# EAGLE design Dachmodul-KS (EAGLE 8.2.0)
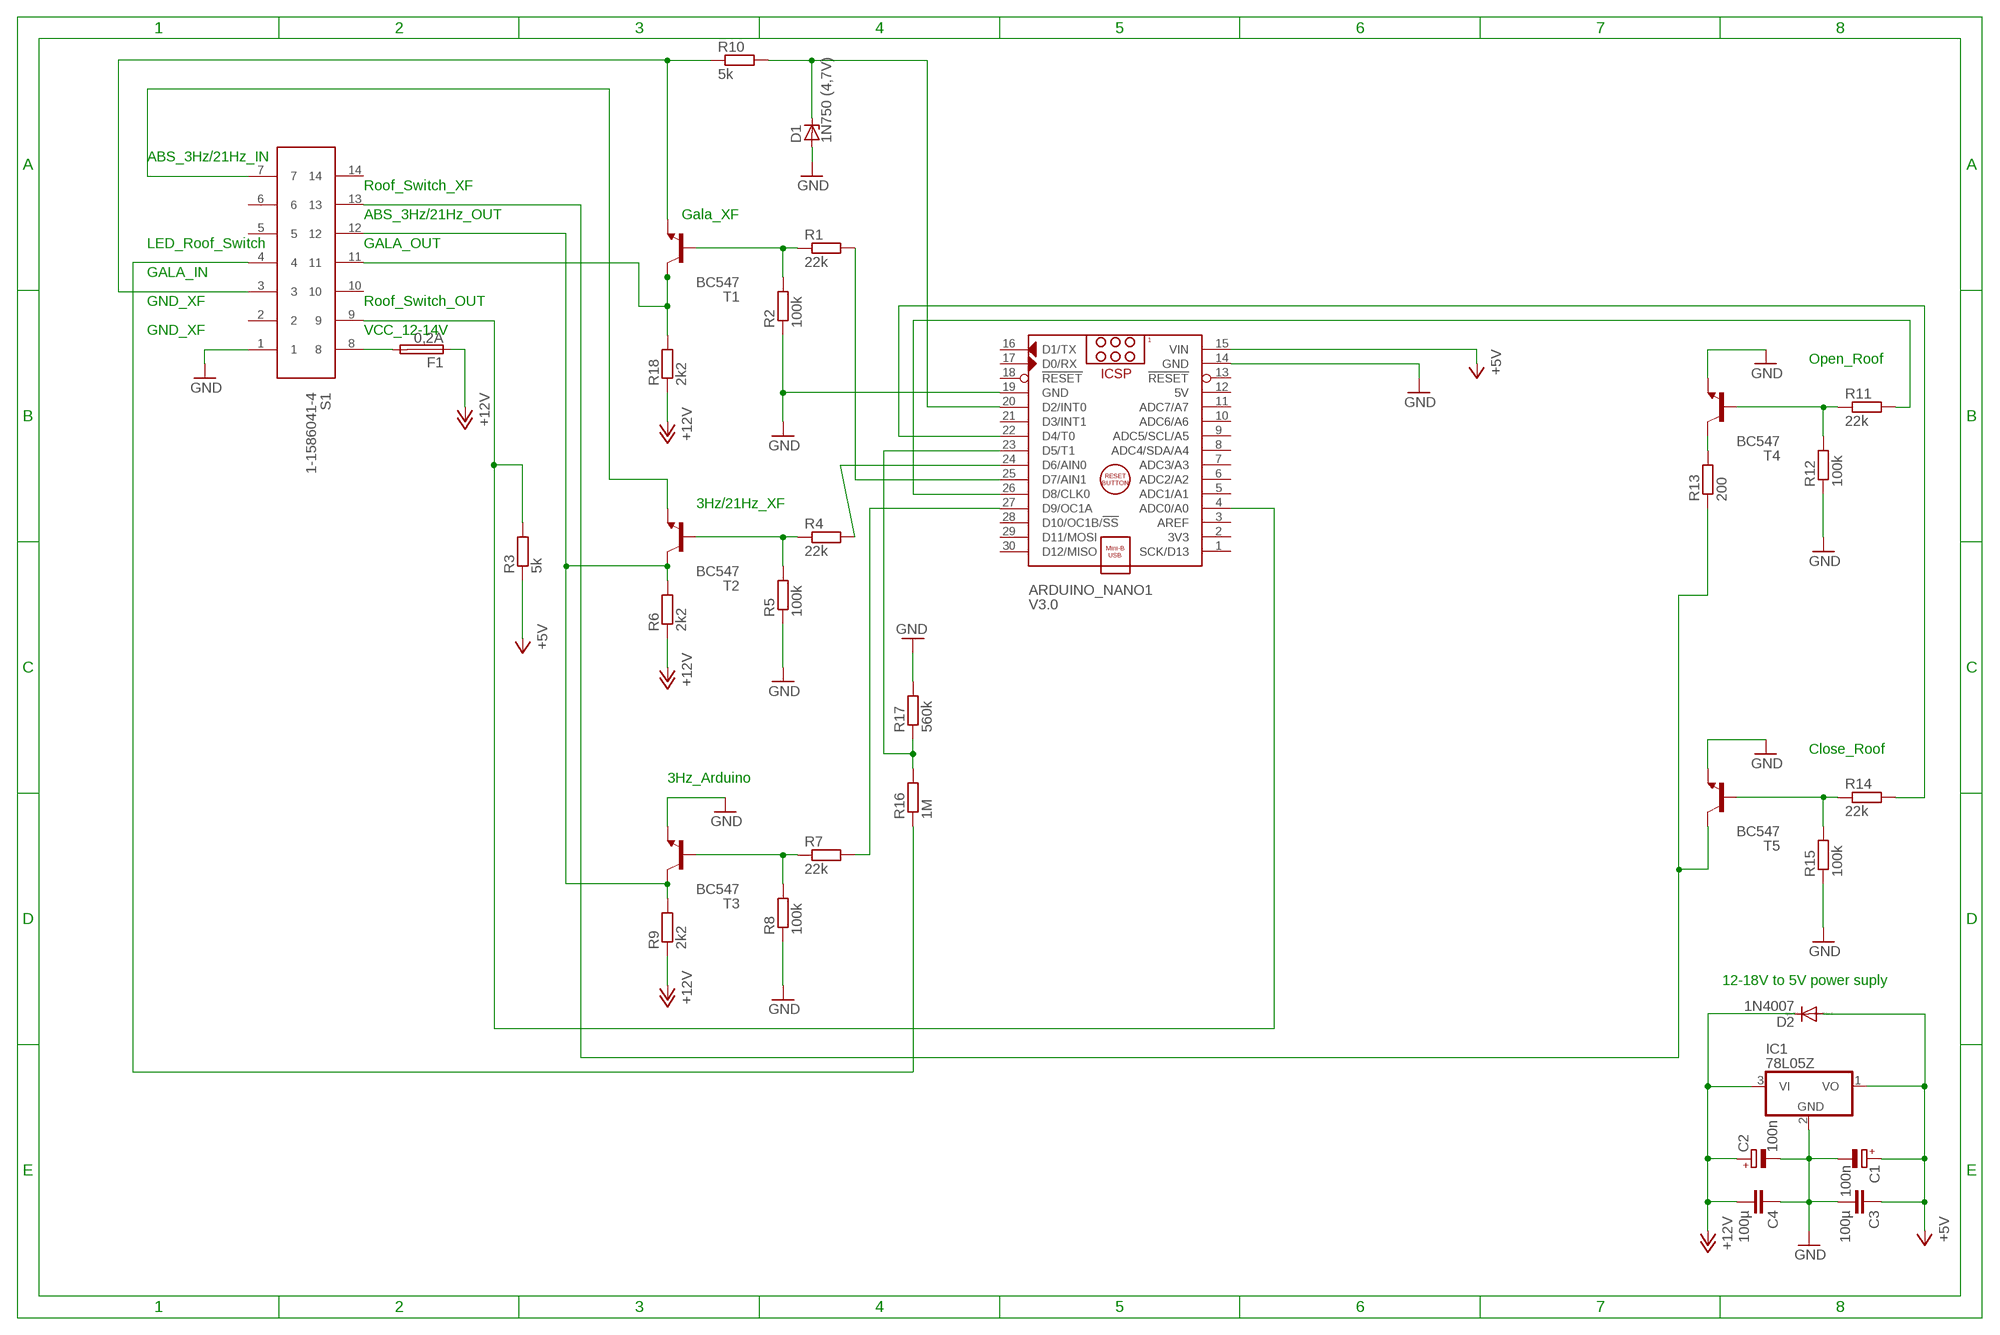
[diagram p0: schematic, sheet 1]

## Parts
ARDUINO_NANO1  V3.0  ARDUINO_NANO  [ARDUINO_NANO]
C1  100n  CPOL-EUE3.5-8  [E3,5-8]
C2  100n  CPOL-EUE3.5-8  [E3,5-8]
C3  100µ  C-EU025-025X050  [C025-025X050]
C4  100µ  C-EU025-025X050  [C025-025X050]
D1  1N750 (4,7V)  ZENER-DIODEZD-2.5  [ZDIO-2.5]
D2  1N4007  1N4004  [DO41-10]
F1  0,2A  SH22,5A  [SH22,5A]
IC1  78L05Z  [TO92]
R1  22k  R-EU_0207/10  [0207/10]
R2  100k  R-EU_0207/10  [0207/10]
R3  5k  R-EU_0207/10  [0207/10]
R4  22k  R-EU_0207/10  [0207/10]
R5  100k  R-EU_0207/10  [0207/10]
R6  2k2  R-EU_0207/10  [0207/10]
R7  22k  R-EU_0207/10  [0207/10]
R8  100k  R-EU_0207/10  [0207/10]
R9  2k2  R-EU_0207/10  [0207/10]
R10  5k  R-EU_0207/10  [0207/10]
R11  22k  R-EU_0207/10  [0207/10]
R12  100k  R-EU_0207/10  [0207/10]
R13  200  R-EU_0207/10  [0207/10]
R14  22k  R-EU_0207/10  [0207/10]
R15  100k  R-EU_0207/10  [0207/10]
R16  1M  R-EU_0207/10  [0207/10]
R17  560k  R-EU_0207/10  [0207/10]
R18  2k2  R-EU_0207/10  [0207/10]
S1  1-1586041-4  64901421022  [64901421022]
T1  BC547  [TO92]
T2  BC547  [TO92]
T3  BC547  [TO92]
T4  BC547  [TO92]
T5  BC547  [TO92]

## Nets
+5V: ARDUINO_NANO1.15(VIN) C1.+ C3.1 D2.A IC1.1(VO) R3.1
+12V: C2.+ C4.2 D2.C F1.1 IC1.3(VI) R6.1 R9.1 R18.1
GND: ARDUINO_NANO1.14(GND) ARDUINO_NANO1.19(GND) C1.- C2.- C3.2 C4.1 D1.A IC1.2(GND) R2.1 R5.1 R8.1 R12.1 R15.1 R17.2 S1.1 T3.1(E) T4.1(E) T5.1(E)
N$1: R1.1 R2.2 T1.2(B)
N$2: R18.2 S1.11 T1.3(C)
N$3: R4.1 R5.2 T2.2(B)
N$4: R6.2 R9.2 S1.12 T2.3(C) T3.3(C)
N$5: R7.1 R8.2 T3.2(B)
N$6: ARDUINO_NANO1.27(D9/OC1A) R7.2
N$7: S1.7 T2.1(E)
N$8: ARDUINO_NANO1.24(D6/AIN0) R4.2
N$9: R10.1 S1.3 T1.1(E)
N$11: ARDUINO_NANO1.25(D7/AIN1) R1.2
N$12: F1.2 S1.8
N$13: R13.2 T4.3(C)
N$14: R11.1 R12.2 T4.2(B)
N$15: ARDUINO_NANO1.26(D8/CLK0) R11.2
N$16: R13.1 S1.13 T5.3(C)
N$17: R14.1 R15.2 T5.2(B)
N$18: ARDUINO_NANO1.22(D4/T0) R14.2
N$20: R16.1 S1.4
N$21: ARDUINO_NANO1.23(D5/T1) R16.2 R17.1
N$35: ARDUINO_NANO1.4(ADC0/A0) R3.2 S1.9
N$36: ARDUINO_NANO1.20(D2/INT0) D1.C R10.2
Unconnected: ARDUINO_NANO1.1(SCK/D13) ARDUINO_NANO1.2(3V3) ARDUINO_NANO1.3(AREF) ARDUINO_NANO1.5(ADC1/A1) ARDUINO_NANO1.6(ADC2/A2) ARDUINO_NANO1.7(ADC3/A3) ARDUINO_NANO1.8(ADC4/SDA/A4) ARDUINO_NANO1.9(ADC5/SCL/A5) ARDUINO_NANO1.10(ADC6/A6) ARDUINO_NANO1.11(ADC7/A7) ARDUINO_NANO1.13(!RESET) ARDUINO_NANO1.16(D1/TX) ARDUINO_NANO1.17(D0/RX) ARDUINO_NANO1.18(!RESET) ARDUINO_NANO1.21(D3/INT1) ARDUINO_NANO1.28(D10/OC1B/!SS) ARDUINO_NANO1.29(D11/MOSI) ARDUINO_NANO1.30(D12/MISO) S1.2 S1.5 S1.6 S1.10 S1.14

## Notes on the sheet
- ABS_3Hz/21Hz_IN
- Roof_Switch_XF
- ABS_3Hz/21Hz_OUT | Gala_XF
- LED_Roof_Switch | GALA_OUT
- GALA_IN
- GND_XF | Roof_Switch_OUT
- GND_XF | VCC_12-14V
- Open_Roof
- 3Hz/21Hz_XF
- Close_Roof
- 3Hz_Arduino
- 12-18V to 5V power suply

## Power pins joined to a net without a drawn wire
5V: ARDUINO_NANO1.12(5V)

## Library data of the parts
ARDUINO_NANO1 = ArduinoNanoV30:ARDUINO_NANO: Arduino Nano V3.0 Module Overview: The Arduino Nano is a small, complete, and breadboard-friendly board based on the ATmega328 (Arduino Nano 3.x) or ATmega168 (Arduino Nano 2.x). It has more or less the same functionality of the Arduino Duemilanove, but in a different package. It lacks only a DC power jack, and works with a Mini-B USB cable instead of a standard one. The Nano was designed and is being produced by Gravitech <http://www.gravitech.us/arna30wiatp.html>. General specifications: Item Value Microcontroller Atmel ATmega168 or ATmega328 Operating Voltage (logic level) 5 V Input Voltage (recommended) 7-12 V Input Voltage (limits) 6-20 V Digital I/O Pins 14 (of which 6 provide PWM output) Analog Input Pins 8 DC Current per I/O Pin 40 mA Flash Memory 16 KB (ATmega168) or 32 KB (ATmega328) of which 2 KB used by bootloader SRAM 1 KB (ATmega168) or 2 KB (ATmega328) EEPROM 512 bytes (ATmega168) or 1 KB (ATmega328) Clock Speed 16 MHz Dimensions (Inches) 0.73" x 1.70" Dimensions (mm) 18mm x 45mm Overall height About 9 mm (not including pins) Weigth 5 g Power: The Arduino Nano can be powered via the Mini-B USB connection, 6-20V unregulated external power supply (pin 30), or 5V regulated external power supply (pin 27). The power source is automatically selected to the highest voltage source. Memory: The ATmega168 has 16 KB of flash memory for storing code (of which 2 KB is used for the bootloader); the ATmega328 has 32 KB, (also with 2 KB used for the bootloader). The ATmega168 has 1 KB of SRAM and 512 bytes of EEPROM (which can be read and written with the EEPROM library); the ATmega328 has 2 KB of SRAM and 1 KB of EEPROM. Input and Output: Each of the 14 digital pins on the Nano can be used as an input or output, using pinMode(), digitalWrite(), and digitalRead() functions. They operate at 5 volts. Each pin can provide or receive a maximum of 40 mA and has an internal pull-up resistor (disconnected by default) of 20-50 kOhms. In addition, some pins have specialized functions. Visit Arduino - ArduinoBoardNano <https://www.arduino.cc/en/Main/ArduinoBoardNano>
C1 C2 = rcl:CPOL-EU: POLARIZED CAPACITOR, European symbol
C3 C4 = rcl:C-EU: CAPACITOR, European symbol
D1 = diode:ZENER-DIODE: Z-Diode
D2 = diode:1N4004: DIODE general purpose rectifier, 1 A
F1 = fuse:SH22,5A: FUSE HOLDER grid 22,5mm, isolated cap OGN0031 8201, Schurter (Buerklin); MPN: 0031.7701.11; OC_FARNELL: unknown; OC_NEWARK: 04F1224
IC1 = linear:78*: Positive VOLTAGE REGULATOR Source: http://cache.national.com/ds/LM/LM78L05.pdf http://www.fairchildsemi.com/ds/LM/LM7805.pdf
R1-R18 = resistor:R-EU_: RESISTOR, European symbol
S1 = Wuerth_Elektronik_eiCan_Mini_Power_Connectors:64901421022: WR-MPC4-4.20mm Male Dual Row Angled Header with Mounting Flanges for Screw-in Retention,14 pins
T1-T5 = transistor:BC547: NPN TRANSISTOR

## Net classes
0 default: clearance 0.205 mm

## Board
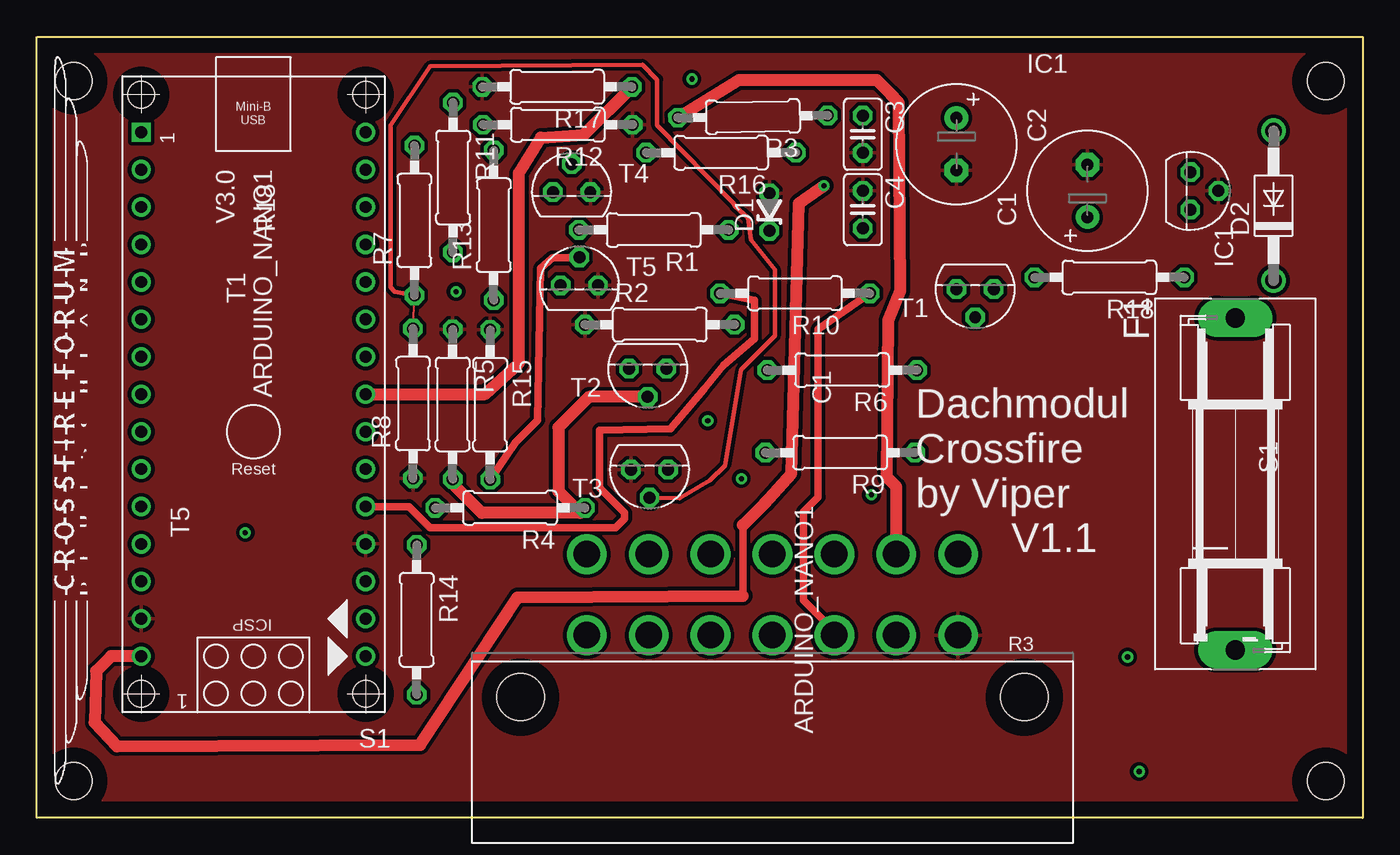
[diagram p1: board, top side]
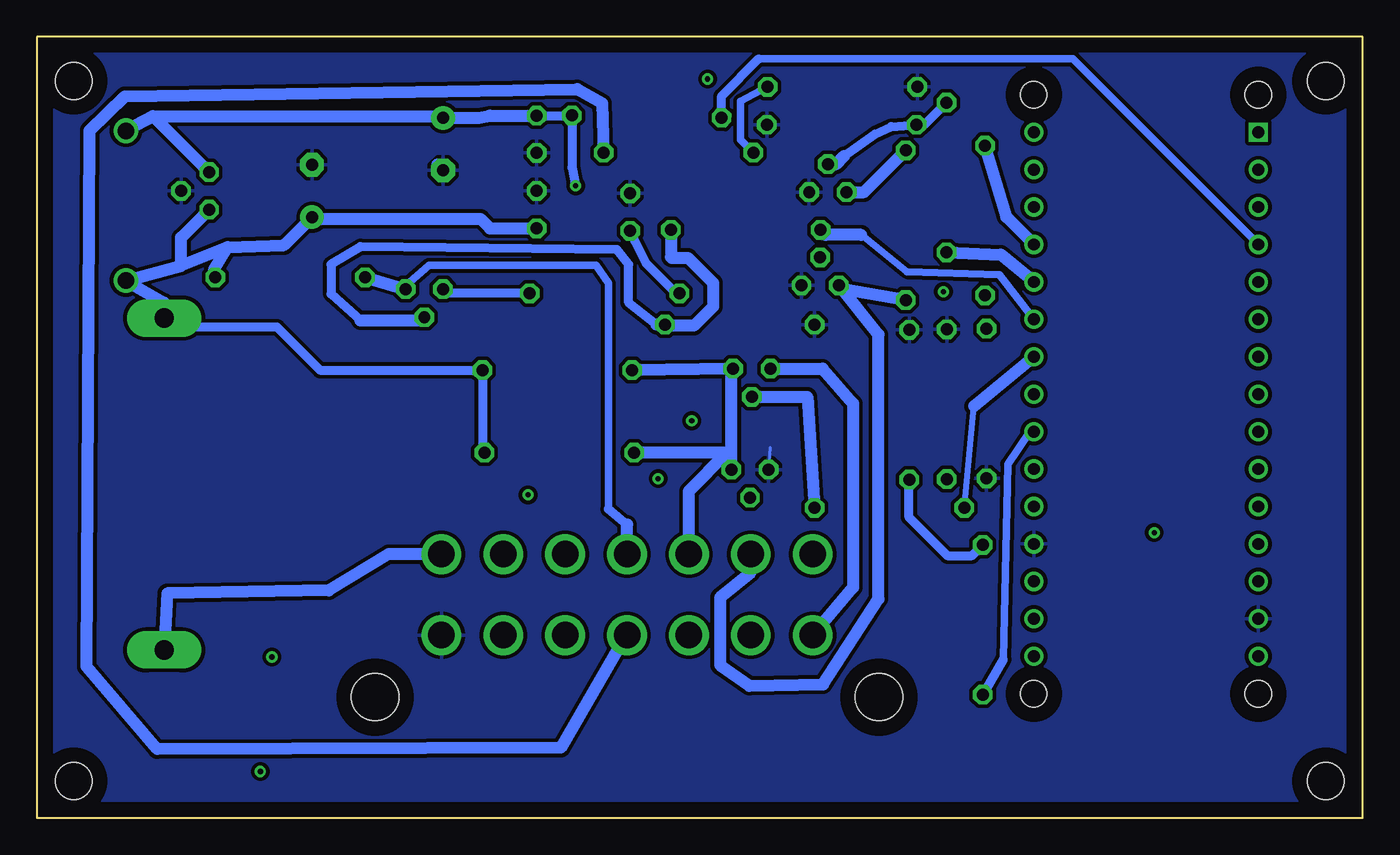
[diagram p2: board, bottom side, seen from below]

Size 90 x 53 mm. Coordinates in mm from the lower left corner, seen from the top.
Outline: 0,0 0,53 90,53 90,0 0,0
Copper layers (1*16): Top 0.035mm / dielectric 0.1mm / Bottom 0.035mm
Design rules "default *": minimum track width 6mil, minimum drill 0.35mm, track to track 6mil, track to pad 6mil, pad to pad 6mil, via to via 6mil, smd to smd 6mil, copper to edge 40mil, drill to drill 6mil, minimum pad ring 10mil, minimum via ring 8mil, stop-mask expansion 4mil, vias tented up to drill 0mil, thermal gap 10mil
Holes 2.5 mm at 2.5,2.5 87.5,2.5 87.5,50 2.5,50

### Footprints (pad centres in the part's own frame; a part is rotated, then mirrored left to right if it is on the bottom)
ARDUINO_NANO = drill 0.8 square: 1 -20.32,-7.62 | drill 0.8: 2 -17.78,-7.62; 3 -15.24,-7.62; 4 -12.7,-7.62; 5 -10.16,-7.62; 6 -7.62,-7.62; 7 -5.08,-7.62; 8 -2.54,-7.62; 9 0,-7.62; 10 2.54,-7.62; 11 5.08,-7.62; 12 7.62,-7.62; 13 10.16,-7.62; 14 12.7,-7.62; 15 15.24,-7.62; 16 15.24,7.62; 17 12.7,7.62; 18 10.16,7.62; 19 7.62,7.62; 20 5.08,7.62; 21 2.54,7.62; 22 0,7.62; 23 -2.54,7.62; 24 -5.08,7.62; 25 -7.62,7.62; 26 -10.16,7.62; 27 -12.7,7.62; 28 -15.24,7.62; 29 -17.78,7.62; 30 -20.32,7.62 | hole 1.778: -22.86,-7.62; -22.86,7.62; 17.78,7.62; 17.78,-7.62
E3,5-8 = drill 0.813 pad 1.6: + -1.778,0 | drill 0.813 pad 1.6 octagon: - 1.778,0
C025-025X050 = drill 0.813 octagon: 1 -1.27,0; 2 1.27,0
ZDIO-2.5 = drill 0.813 octagon: A 1.27,0; C -1.27,0
DO41-10 = drill 1.118: A 5.08,0; C -5.08,0
SH22,5A = drill 1.321 pad 2.54 long: 1 -11.252,0; 2 11.252,0
TO92 = drill 0.813 octagon: 1 -1.27,0; 2 0,1.905; 3 1.27,0
0207/10 = drill 0.813 octagon: 1 -5.08,0; 2 5.08,0
64901421022 = drill 1.8: 1 12.635,-2.75; 2 8.435,-2.75; 3 4.235,-2.75; 4 0.035,-2.75; 5 -4.165,-2.75; 6 -8.365,-2.75; 7 -12.565,-2.75; 8 12.635,2.75; 9 8.435,2.75; 10 4.235,2.75; 11 0.035,2.75; 12 -4.165,2.75; 13 -8.365,2.75; 14 -12.565,2.75 | hole 3.2: -17.065,-6.95; 17.135,-6.95
TO92' = drill 0.813 octagon: 1 1.27,0; 2 0,1.905; 3 -1.27,0

### Placement (x,y rotation side)
ARDUINO_NANO1  14.71,26.21 270 top
C1  62.42,45.72 270 top
C2  71.31,42.55 90 top
C3  56.08,46.39 270 top
C4  56.08,41.27 270 top
D1  49.72,41.11 90 top
D2  83.95,41.55 90 top
F1  81.36,22.66 270 top
IC1  78.3,42.55 270 top
R1  41.88,39.9 180 top
R2  42.29,33.47 0 top
R3  48.6,47.59 180.9 top
R4  32.12,21.04 180 top
R5  28.23,28.07 270 top
R6  54.67,30.39 180 top
R7  25.64,40.54 90 top
R8  25.54,28.11 90 top
R9  54.53,24.79 180 top
R10  51.46,35.59 180 top
R11  28.25,43.45 270 top
R12  35.36,47.03 180 top
R13  31.02,40.22 90 top
R14  25.79,13.45 270 top
R15  30.77,28.04 270 top
R16  46.45,45.14 180 top
R17  35.32,49.61 180 top
R18  72.8,36.68 180 top
S1  49.9,15.14 0 top
T1  BC547  [TO92']  63.7,35.88 180 top
T2  BC547  [TO92']  41.47,30.48 180 top
T3  BC547  [TO92']  41.59,23.64 180 top
T4  BC547  [TO92']  36.3,42.47 0 top
T5  BC547  [TO92']  36.83,36.13 0 top

### Tracks (layer width: path | path; a pad name or v marks a point on that pad's centre or on a via)
+5V  (via drill 0.35)
  Top 0.508: 47.92,15.06 47.92,19.86
  Top 0.813: ARDUINO_NANO1.15 5.04,10.97 4.03,9.96 3.92,6.46 5.42,4.86 26.02,4.96 32.62,14.96 47.92,15.06 | v53.42,42.9 51.73,41.7 51.23,23.36 49.42,21.36 47.92,19.86
  Bottom 0.254: ARDUINO_NANO1.15 7.62,10.97
  Bottom 0.61: C3.1 R3.1 53.68,44.15 v53.42,42.9
  Bottom 0.813: 82.11,47.62 D2.A | 82.11,47.62 IC1.1 | 82.11,47.62 62.55,47.62 C1.+ 60.01,47.5 59.25,47.66 C3.1
+12V
  Bottom 0.61: F1.1 80.75,33.3 73.7,33.3 70.78,30.39 R6.1 59.75,24.93 R9.1
  Bottom 0.813: 80.2,37.47 D2.C 81.36,34.97 F1.1 | 80.2,37.47 80.2,39.37 IC1.3 | 77.03,38.73 80.2,37.47 | 77.03,38.73 73.22,38.86 C2.+ 71.31,40.64 59.88,40.64 59.25,40.01 C4.2 | R18.1 77.98,37.15 77.03,38.73
GND
  Bottom 0.203: 40.23,25.14 T3.1
  Bottom 0.813: 62.81,44.32 C1.-
  pour Top (isolate 0.254): 0,0 0,53 90,53 90,0
  pour Bottom (isolate 0.254): 0,0 0,53 90,53 90,0
N$1
  Bottom 0.305: 63.91,33.76 T1.2
  Bottom 0.61: 47.94,33.47 49.83,34.96 49.83,37.56 50.62,38.56 68.03,38.76 70.03,37.56 70.03,35.56 68.03,33.76
  Bottom 0.813: 47.94,33.47 R2.2 47.3,33.4 45.4,33.4 44.1,34.7 44.1,36.3 45.8,38 46.9,38 46.95,38.05 R1.1 | 68.03,33.76 63.91,33.76
N$2
  Bottom 0.508: 51.2,20.95 51.2,36.27 52.03,37.5 63.38,37.5 64.97,36.11
  Bottom 0.61: 49.94,19.89 51.2,20.95
  Bottom 0.813: R18.2 T1.3 64.97,36.11 | S1.11 49.94,19.89
N$3
  Top 0.813: R5.2 28.23,22.68 30.2,20.7 36.87,20.7 | 36.87,20.7 R4.1 | T2.2 37.48,28.57 35.4,26.5 35.4,22.16 36.87,20.7
  Bottom 0.813: T2.2 37.7,28.57 R4.1
N$4
  Bottom 0.254: T2.3
  Bottom 0.508: R9.2 49.69,24.8 49.73,24.77 | 43.13,24.77 T3.3
  Bottom 0.61: T3.3 42.86,25.8
  Bottom 0.813: 49.73,24.77 43.13,24.77 45.73,22.16 S1.12 | R6.2 T2.3 42.86,30.37 T3.3
N$5
  Top 0.152: R8.2 R7.1
  Top 0.305: R7.1 24.3,35.7 24,36 24,47 26.7,51 41.1,51.1 42.1,50.1 42.1,47 47.3,41.7 47.4,41.49 48.27,40.72 48.47,39.23 50.1,37.2 50.1,32.7 47.8,30.4 46.7,23.9 45.7,22.9 43.62,21.7 T3.2
N$6
  Bottom 0.813: R7.2 24.2,40.78 ARDUINO_NANO1.27
N$7
  Bottom 0.813: T2.1 36.66,30.48 34.59,28.11 34.59,15.64 S1.7
N$8
  Bottom 0.406: R4.2 26.38,27.94
  Bottom 0.813: 26.38,27.94 ARDUINO_NANO1.24
N$9
  Top 0.508: S1.3 54.13,12.65 52.02,14.76 52.02,20.76 53.02,21.76 53.02,33.17 R10.1
  Bottom 0.61: R10.1 62.14,35.59 T1.1
N$10  (via drill 0.35)
  other vias: 14.15,19.35
N$11
  Bottom 0.508: 34.02,39.56 30.93,37.06 24.66,36.86 ARDUINO_NANO1.25
  Bottom 0.813: 34.02,39.56 36.46,39.56 R1.2
N$12
  Bottom 0.813: S1.8 66.12,17.89 70.17,15.44 81.15,15.24 F1.2
N$13
  Bottom 0.813: T4.3 33.85,42.47 R13.2
N$14
  Bottom 0.61: 35.2,44.9 33.1,46.4 32,46.91 R12.2 29.75,47.03 R11.1
  Bottom 0.813: T4.2 35.73,44.37 35.2,44.9
N$15
  Bottom 0.813: R11.2 24.57,38.22 ARDUINO_NANO1.26
N$16
  Bottom 0.813: S1.13 41.53,16.67 43.62,14.96 43.62,10.36 41.62,8.96 36.62,9.06 32.86,14.86 32.86,32.8 T5.3 35.3,35.88 R13.1
N$17
  Top 0.508: R15.2 32.5,25.5 34,27 34.2,37.3 35,38 36.79,38 T5.2
  Bottom 0.61: R15.2 30.8,22.93 30.8,20.4 28.2,17.8 26.51,17.8 R14.1
N$18
  Bottom 0.508: 22.59,26.21 24.1,24 24.4,10.75
  Bottom 0.61: ARDUINO_NANO1.22 22.59,26.21 | 24.4,10.75 R14.2
N$19  (via drill 0.35)
  other vias: 56.65,21.92
N$20
  Bottom 0.813: S1.4 49.99,12.39 54.42,4.76 81.83,4.66 86.62,10.26 86.42,46.66 84.03,48.96 53.33,49.46 51.62,48.48 R16.1
N$21
  Top 0.813: ARDUINO_NANO1.23 30.41,28.75 32.73,30.86 32.73,43.76 34.23,46.16 37.11,46.36 R17.1
  Bottom 0.508: R17.1 42.23,48.64 42.23,46.01 R16.2
N$22  (via drill 0.35)
  other vias: 47.83,23.02
N$23  (via drill 0.35)
  other vias: 45.55,26.95
N$24  (via drill 0.35)
  other vias: 28.46,35.71
N$25  (via drill 0.35)
  other vias: 74.04,10.92
N$26  (via drill 0.35)
  other vias: 44.47,50.14
N$27  (via drill 0.35)
  other vias: 74.83,3.15
N$35
  Top 0.813: R3.2 47.67,50.06 57.02,50.06 57.94,49.15 58.51,48.53 58.61,35.77 57.8,33.76 57.7,23.1 58.34,22.46 S1.9
  Bottom 0.508: 41,51.5 19.68,51.5 ARDUINO_NANO1.4
  Bottom 0.61: R3.2 43.52,48.98 41,51.5
N$36
  Top 0.508: R10.2 48.7,35.12 48.7,32.5 46.6,30.7 45.3,29.1 43,26.4 38.2,26.31 38.2,22.4 39.9,20.7 39.9,20.3 39.3,19.7 38.09,19.7 38.08,19.7 26.7,19.7 25.27,21.13 ARDUINO_NANO1.20
  Bottom 0.61: R10.2 46.59,35.59 48.6,37.6 49.4,39.16 D1.C

### Text on the board
tPlace: Dachmodul / Crossfire / by Viper | V1.1 | /home/viper/Bilder/Bilder/CFD/Forenlogo/CFD-Logo.bmp
_tPlace: ARDUINO_NANO1
_tNames: T4 | T3 | T2 | F1 | R17 | R16 | R15 | R14 | R13 | R12 | R11 | R10 | R9 | R8 | R7 | R6 | R5 | C4 | R4 | R2 | R1 | D1 | C3 | IC1 | C2 | D2 | R18 | T1 | C1 | S1 | T5 | R3